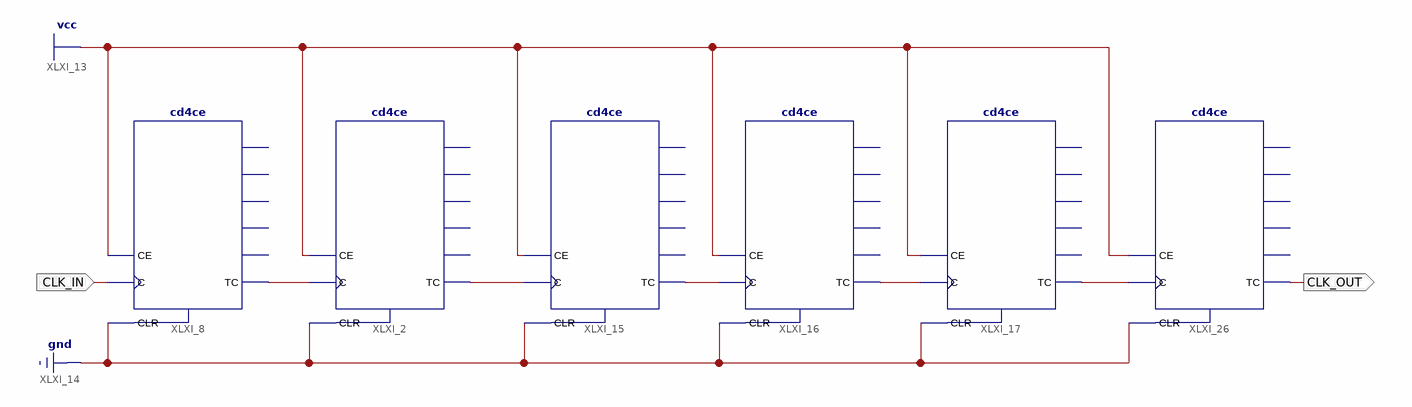
[diagram p0: schematic sheet 1]
// Xilinx ISE schematic DIV_1M.sch (spartan6) as structural Verilog: 6 symbols, 2 ports
module DIV_1M (
  input  CLK_IN,
  output CLK_OUT
);

  wire XLXN_4, XLXN_24, XLXN_25, XLXN_27, XLXN_53;

  cd4ce XLXI_2 (.C(XLXN_4), .CE(1'b1), .CLR(1'b0), .TC(XLXN_24));  // open: CEO, Q0, Q1, Q2, Q3
  cd4ce XLXI_8 (.C(CLK_IN), .CE(1'b1), .CLR(1'b0), .TC(XLXN_4));  // open: CEO, Q0, Q1, Q2, Q3
  cd4ce XLXI_15 (.C(XLXN_24), .CE(1'b1), .CLR(1'b0), .TC(XLXN_25));  // open: CEO, Q0, Q1, Q2, Q3
  cd4ce XLXI_16 (.C(XLXN_25), .CE(1'b1), .CLR(1'b0), .TC(XLXN_27));  // open: CEO, Q0, Q1, Q2, Q3
  cd4ce XLXI_17 (.C(XLXN_27), .CE(1'b1), .CLR(1'b0), .TC(XLXN_53));  // open: CEO, Q0, Q1, Q2, Q3
  cd4ce XLXI_26 (.C(XLXN_53), .CE(1'b1), .CLR(1'b0), .TC(CLK_OUT));  // open: CEO, Q0, Q1, Q2, Q3
endmodule
